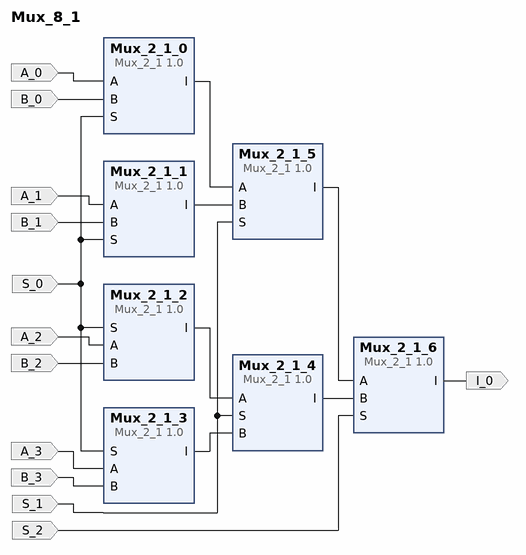
[diagram p0: block diagram of the top level]
# Vivado block design Mux_8_1, xc7z010clg400-1, Vivado 2019.1
create_bd_design Mux_8_1

create_bd_port -dir I S_0
create_bd_port -dir I S_1
create_bd_port -dir I S_2
create_bd_port -dir O I_0
create_bd_port -dir I A_0
create_bd_port -dir I B_0
create_bd_port -dir I A_1
create_bd_port -dir I B_1
create_bd_port -dir I A_2
create_bd_port -dir I B_2
create_bd_port -dir I A_3
create_bd_port -dir I B_3

create_bd_cell -type ip -vlnv xilinx.com:user:Mux_2_1:1.0 Mux_2_1_0
create_bd_cell -type ip -vlnv xilinx.com:user:Mux_2_1:1.0 Mux_2_1_1
create_bd_cell -type ip -vlnv xilinx.com:user:Mux_2_1:1.0 Mux_2_1_2
create_bd_cell -type ip -vlnv xilinx.com:user:Mux_2_1:1.0 Mux_2_1_3
create_bd_cell -type ip -vlnv xilinx.com:user:Mux_2_1:1.0 Mux_2_1_4
create_bd_cell -type ip -vlnv xilinx.com:user:Mux_2_1:1.0 Mux_2_1_5
create_bd_cell -type ip -vlnv xilinx.com:user:Mux_2_1:1.0 Mux_2_1_6

# ---- connections ----

connect_bd_net [get_bd_pins Mux_2_1_0/I] [get_bd_pins Mux_2_1_5/A]
connect_bd_net [get_bd_pins Mux_2_1_1/I] [get_bd_pins Mux_2_1_5/B]
connect_bd_net [get_bd_pins Mux_2_1_2/I] [get_bd_pins Mux_2_1_4/A]
connect_bd_net [get_bd_pins Mux_2_1_3/I] [get_bd_pins Mux_2_1_4/B]
connect_bd_net [get_bd_pins Mux_2_1_5/I] [get_bd_pins Mux_2_1_6/A]
connect_bd_net [get_bd_pins Mux_2_1_4/I] [get_bd_pins Mux_2_1_6/B]
connect_bd_net -net S_0_1 [get_bd_ports S_0] [get_bd_pins Mux_2_1_3/S] [get_bd_pins Mux_2_1_2/S] [get_bd_pins Mux_2_1_1/S] [get_bd_pins Mux_2_1_0/S]
connect_bd_net -net S_1_1 [get_bd_ports S_1] [get_bd_pins Mux_2_1_4/S] [get_bd_pins Mux_2_1_5/S]
connect_bd_net -net S_2_1 [get_bd_ports S_2] [get_bd_pins Mux_2_1_6/S]
connect_bd_net [get_bd_pins Mux_2_1_6/I] [get_bd_ports I_0]
connect_bd_net -net A_0_1 [get_bd_ports A_0] [get_bd_pins Mux_2_1_0/A]
connect_bd_net -net B_0_1 [get_bd_ports B_0] [get_bd_pins Mux_2_1_0/B]
connect_bd_net -net A_1_1 [get_bd_ports A_1] [get_bd_pins Mux_2_1_1/A]
connect_bd_net -net B_1_1 [get_bd_ports B_1] [get_bd_pins Mux_2_1_1/B]
connect_bd_net -net A_2_1 [get_bd_ports A_2] [get_bd_pins Mux_2_1_2/A]
connect_bd_net -net B_2_1 [get_bd_ports B_2] [get_bd_pins Mux_2_1_2/B]
connect_bd_net -net A_3_1 [get_bd_ports A_3] [get_bd_pins Mux_2_1_3/A]
connect_bd_net -net B_3_1 [get_bd_ports B_3] [get_bd_pins Mux_2_1_3/B]

validate_bd_design
save_bd_design
